# EAGLE design Crossing_v1_0 (EAGLE 9.6.2)
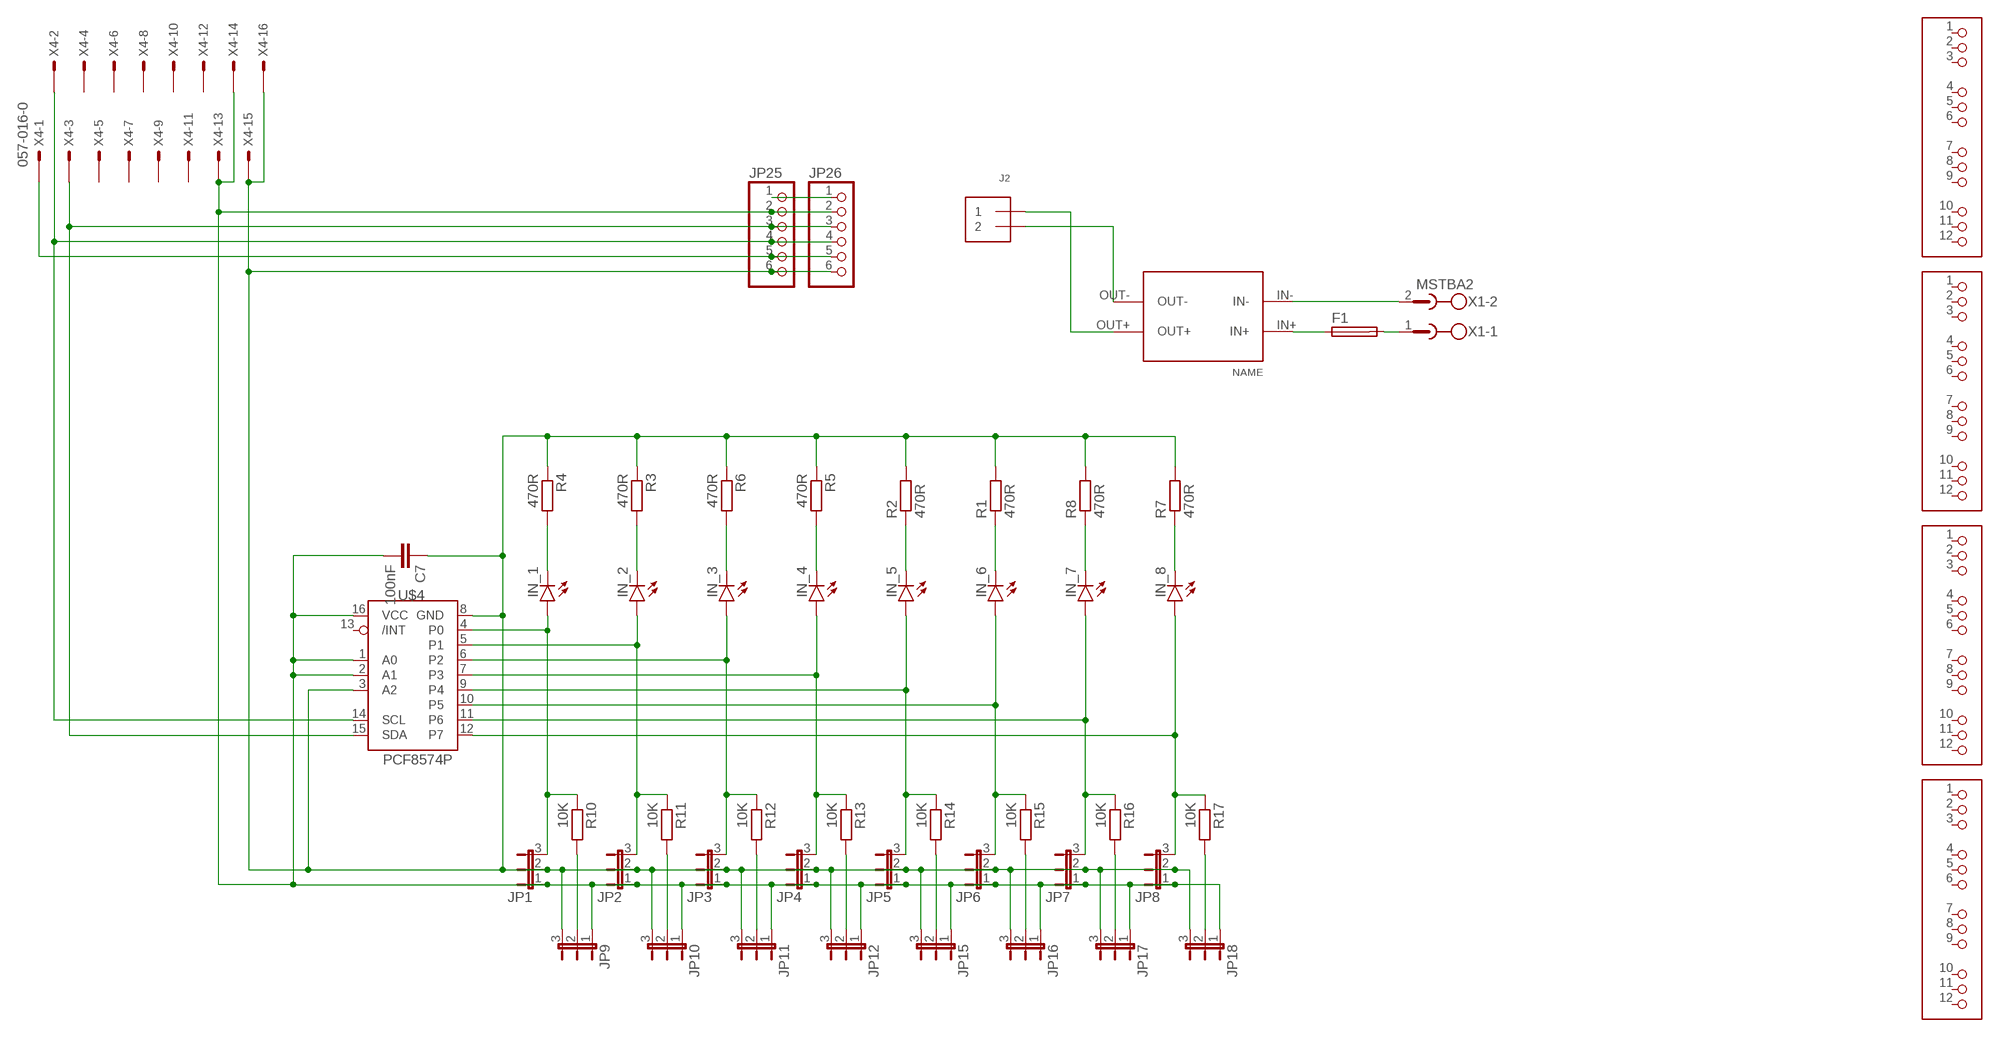
[diagram p0: schematic, sheet 1]

## Parts
C7  100nF  C-EU025-024X044  [C025-024X044]
F1  SH25  [SH25]
IN_1  LED3MM  [LED3MM]
IN_2  LED3MM  [LED3MM]
IN_3  LED3MM  [LED3MM]
IN_4  LED3MM  [LED3MM]
IN_5  LED3MM  [LED3MM]
IN_6  LED3MM  [LED3MM]
IN_7  LED3MM  [LED3MM]
IN_8  LED3MM  [LED3MM]
J2  TERMBLOCK_1X2  [TERMBLOCK_1X2-3.5MM]
JP1  JP2E  [JP2]
JP2  JP2E  [JP2]
JP3  JP2E  [JP2]
JP4  JP2E  [JP2]
JP5  JP2E  [JP2]
JP6  JP2E  [JP2]
JP7  JP2E  [JP2]
JP8  JP2E  [JP2]
JP9  JP2E  [JP2]
JP10  JP2E  [JP2]
JP11  JP2E  [JP2]
JP12  JP2E  [JP2]
JP15  JP2E  [JP2]
JP16  JP2E  [JP2]
JP17  JP2E  [JP2]
JP18  JP2E  [JP2]
JP25  PINHD-1X6CB  [1X06-CLEANBIG]
JP26  PINHD-1X6CB  [1X06-CLEANBIG]
JP27  HEADER-3X04  [3X04]
JP28  HEADER-3X04  [3X04]
JP29  HEADER-3X04  [3X04]
JP30  HEADER-3X04  [3X04]
R1  470R  R-EU_0309/10  [0309/10]
R2  470R  R-EU_0309/10  [0309/10]
R3  470R  R-EU_0309/10  [0309/10]
R4  470R  R-EU_0309/10  [0309/10]
R5  470R  R-EU_0309/10  [0309/10]
R6  470R  R-EU_0309/10  [0309/10]
R7  470R  R-EU_0309/10  [0309/10]
R8  470R  R-EU_0309/10  [0309/10]
R10  10K  R-EU_0309/10  [0309/10]
R11  10K  R-EU_0309/10  [0309/10]
R12  10K  R-EU_0309/10  [0309/10]
R13  10K  R-EU_0309/10  [0309/10]
R14  10K  R-EU_0309/10  [0309/10]
R15  10K  R-EU_0309/10  [0309/10]
R16  10K  R-EU_0309/10  [0309/10]
R17  10K  R-EU_0309/10  [0309/10]
U$2  CP8-ADJ  [CP8-ADJ]
U$4  PCF8574P  [DIL16]
X1  MSTBA2  [MSTBA2]
X4  057-016-0  [057-016-0]

## Nets
N$1: J2.2 U$2.OUT-
N$2: J2.1 U$2.OUT+
N$3: JP25.4 JP26.4 U$4.14(SCL) X4.2
N$4: JP25.5 JP26.5 X4.1
N$5: C7.1 JP1.2 JP2.2 JP3.2 JP4.2 JP5.2 JP6.2 JP7.2 JP8.2 JP9.3 JP10.3 JP11.3 JP12.3 JP15.3 JP16.3 JP17.3 JP18.3 JP25.6 JP26.6 R1.2 R2.2 R3.1 R4.1 R5.1 R6.1 R7.2 R8.2 U$4.3(A2) U$4.8(GND) X4.15 X4.16
N$6: JP25.1 JP26.1
N$7: C7.2 JP1.1 JP2.1 JP3.1 JP4.1 JP5.1 JP6.1 JP7.1 JP8.1 JP9.1 JP10.1 JP11.1 JP12.1 JP15.1 JP16.1 JP17.1 JP18.1 JP25.2 JP26.2 U$4.1(A0) U$4.2(A1) U$4.16(VCC) X4.13 X4.14
N$8: U$2.IN- X1.2
N$9: F1.1 U$2.IN+
N$10: F1.2 X1.1
N$11: JP25.3 JP26.3 U$4.15(SDA) X4.3
N$12: IN_8.K(C) R7.1
N$13: IN_7.K(C) R8.1
N$14: IN_6.K(C) R1.1
N$15: IN_5.K(C) R2.1
N$16: IN_4.K(C) R5.2
N$17: IN_3.K(C) R6.2
N$18: IN_2.K(C) R3.2
N$19: IN_1.K(C) R4.2
N$21: IN_1.A JP1.3 R10.1 U$4.4(P0)
N$22: IN_2.A JP2.3 R11.1 U$4.5(P1)
N$23: IN_3.A JP3.3 R12.1 U$4.6(P2)
N$24: IN_4.A JP4.3 R13.1 U$4.7(P3)
N$25: IN_5.A JP5.3 R14.1 U$4.9(P4)
N$26: IN_6.A JP6.3 R15.1 U$4.10(P5)
N$27: IN_7.A JP7.3 R16.1 U$4.11(P6)
N$28: IN_8.A JP8.3 R17.1 U$4.12(P7)
N$29: JP9.2 R10.2
N$30: JP10.2 R11.2
N$31: JP11.2 R12.2
N$32: JP12.2 R13.2
N$33: JP15.2 R14.2
N$34: JP16.2 R15.2
N$35: JP17.2 R16.2
N$36: JP18.2 R17.2
Unconnected: JP27.1 JP27.2 JP27.3 JP27.4 JP27.5 JP27.6 JP27.7 JP27.8 JP27.9 JP27.10 JP27.11 JP27.12 JP28.1 JP28.2 JP28.3 JP28.4 JP28.5 JP28.6 JP28.7 JP28.8 JP28.9 JP28.10 JP28.11 JP28.12 JP29.1 JP29.2 JP29.3 JP29.4 JP29.5 JP29.6 JP29.7 JP29.8 JP29.9 JP29.10 JP29.11 JP29.12 JP30.1 JP30.2 JP30.3 JP30.4 JP30.5 JP30.6 JP30.7 JP30.8 JP30.9 JP30.10 JP30.11 JP30.12 U$4.13(/INT) X4.4 X4.5 X4.6 X4.7 X4.8 X4.9 X4.10 X4.11 X4.12

## Library data of the parts
C7 = resistor:C-EU: CAPACITOR, European symbol
F1 = fuse:SH25: FUSE HOLDER grid 25 mm, OGN0031 8211, Schurter (Buerklin); MF: SCHURTER; MPN: 0031.8211; OC_FARNELL: 1162741; OC_NEWARK: 96B9380
IN_1-IN_8 = led:LED: LED OSRAM: - CHIPLED LG R971, LG N971, LY N971, LG Q971, LY Q971, LO R971, LY R971 LH N974, LH R974 LS Q976, LO Q976, LY Q976 LO Q996 - Hyper CHIPLED LW Q18S LB Q993, LB Q99A, LB R99A - SideLED LS A670, LO A670, LY A670, LG A670, LP A670 LB A673, LV A673, LT A673, LW A673 LH A674 LY A675 LS A676, LA A676, LO A676, LY A676, LW A676 LS A679, LY A679, LG A679 - Hyper Micro SIDELED® LS Y876, LA Y876, LO Y876, LY Y876 LT Y87S - SmartLED LW L88C, LW L88S LB L89C, LB L89S, LG L890 LS L89K, LO L89K, LY L89K LS L896, LA L896, LO L896, LY L896 - TOPLED LS T670, LO T670, LY T670, LG T670, LP T670 LSG T670, LSP T670, LSY T670, LOP T670, LYG T670 LG T671, LOG T671, LSG T671 LB T673, LV T673, LT T673, LW T673 LH T674 LS T676, LA T676, LO T676, LY T676, LB T676, LH T676, LSB T676, LW T676 LB T67C, LV T67C, LT T67C, LS T67K, LO T67K, LY T67K, LW E67C LS E67B, LA E67B, LO E67B, LY E67B, LB E67C, LV E67C, LT E67C LW T67C LS T679, LY T679, LG T679 LS T770, LO T770, LY T770, LG T770, LP T770 LB T773, LV T773, LT T773, LW T773 LH T774 LS E675, LA E675, LY E675, LS T675 LS T776, LA T776, LO T776, LY T776, LB T776 LHGB T686 LT T68C, LB T68C - Hyper Mini TOPLED® LB M676 - Mini TOPLED Santana® LG M470 LS M47K, LO M47K, LY M47K Source: http://www.osram.convergy.de LUXEON: - LUMILED® LXK2-PW12-R00, LXK2-PW12-S00, LXK2-PW14-U00, LXK2-PW14-V00 LXK2-PM12-R00, LXK2-PM12-S00, LXK2-PM14-U00 LXK2-PE12-Q00, LXK2-PE12-R00, LXK2-PE12-S00, LXK2-PE14-T00, LXK2-PE14-U00 LXK2-PB12-K00, LXK2-PB12-L00, LXK2-PB12-M00, LXK2-PB14-N00, LXK2-PB14-P00, LXK2-PB14-Q00 LXK2-PR12-L00, LXK2-PR12-M00, LXK2-PR14-Q00, LXK2-PR14-R00 LXK2-PD12-Q00, LXK2-PD12-R00, LXK2-PD12-S00 LXK2-PH12-R00, LXK2-PH12-S00 LXK2-PL12-P00, LXK2-PL12-Q00, LXK2-PL12-R00 Source: www.luxeon.com KINGBRIGHT: KA-3528ASYC Source: www.kingbright.com
J2 = microbuilder:TERMBLOCK_1X2: 3.5mm Terminal block http://www.ladyada.net/library/pcb/eaglelibrary.html
JP1-JP12 JP15-JP18 = jumper:JP2E: JUMPER
JP25 JP26 = adafruit:PINHD-1X6: PIN HEADER
JP27-JP30 = microbuilder:HEADER-3X04
R1-R8 R10-R17 = resistor:R-EU_: RESISTOR, European symbol
U$2 = userlib:CP8-ADJ: Voltage regulator IN: 7-35V OUT: ADJ
U$4 = i2c:PCF8574: Remote 8-Bit I/O Expander for I²C Bus
X1 = con-phoenix-508:MSTBA2: PHOENIX; MF: FARNELL; MPN: 1757242; OC_FARNELL: 3705171; OC_NEWARK: 71C4161
X4 = con-panduit:057-016-: CONNECTOR 10-pin series 057 contact pc board low profile headers; OC_FARNELL: unknown; OC_NEWARK: unknown

## Board
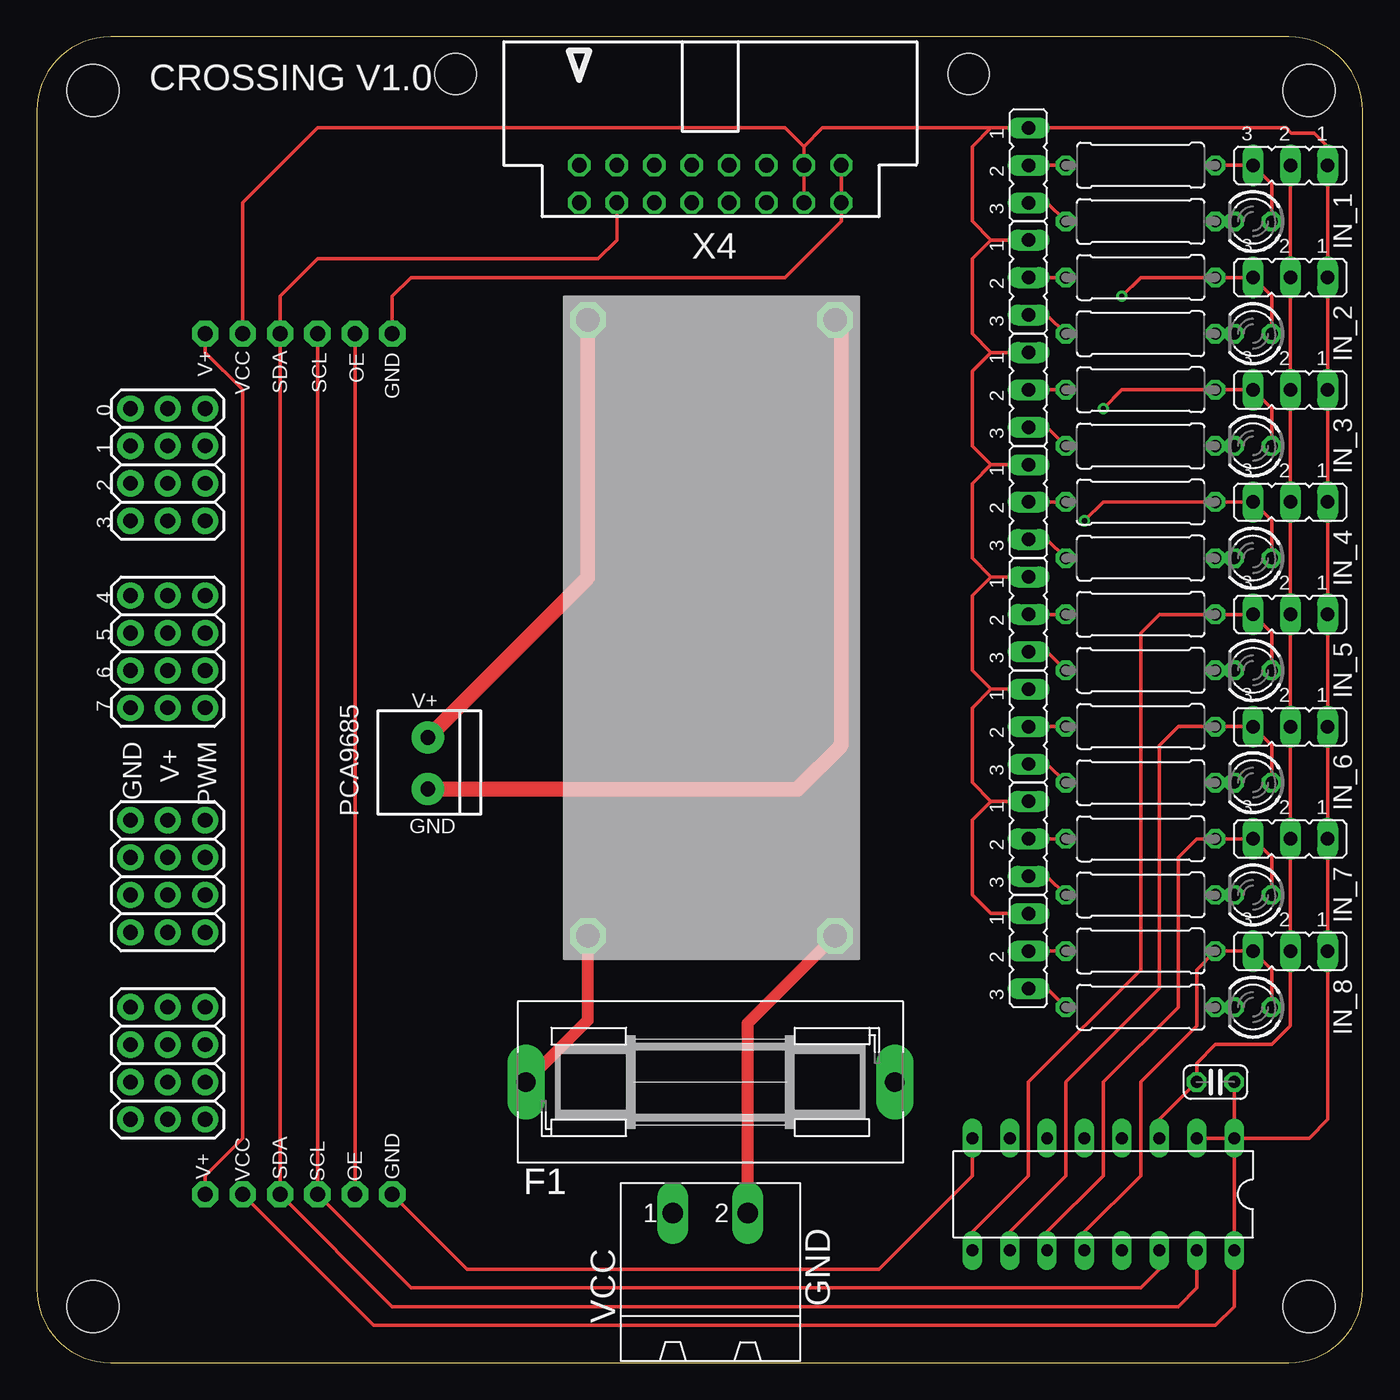
[diagram p1: board, top side]
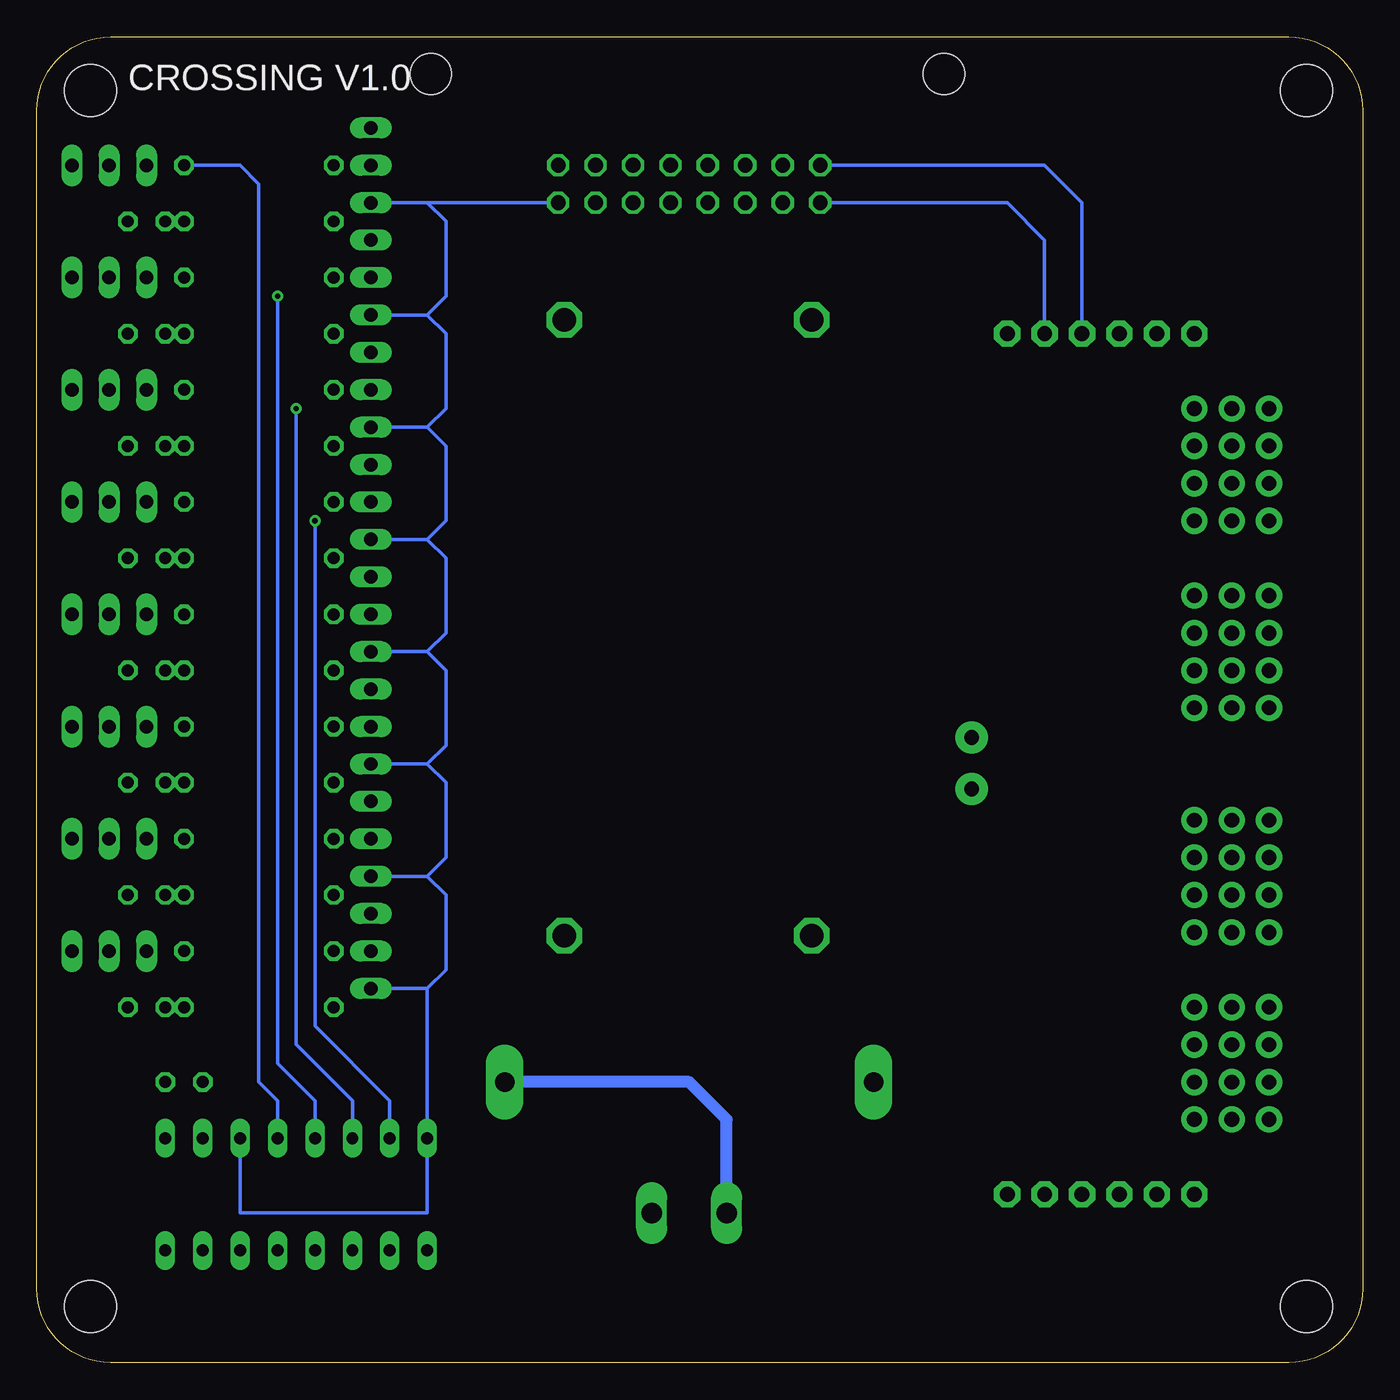
[diagram p2: board, bottom side, seen from below]

Size 90 x 90 mm. Coordinates in mm from the lower left corner, seen from the top.
Outline: 0,85 0,5 arc90 5,0 85,0 arc90 90,5 90,85 arc90 85,90 5,90 arc90 0,85
Copper layers (1*16): Top 0.035mm / dielectric 1.5mm / Bottom 0.035mm
Design rules "default": minimum track width 6mil, minimum drill 0.35mm, track to track 6mil, track to pad 6mil, pad to pad 6mil, via to via 6mil, smd to smd 6mil, copper to edge 40mil, drill to drill 6mil, minimum pad ring 10mil, minimum via ring 8mil, stop-mask expansion 4mil, vias tented up to drill 0mil, thermal gap 10mil
Holes 3.5 mm at 86.36,86.36 3.81,86.36 3.81,3.81 86.36,3.81

### Footprints (pad centres in the part's own frame; a part is rotated, then mirrored left to right if it is on the bottom)
C025-024X044 = drill 0.813 octagon: 1 -1.27,0; 2 1.27,0
SH25 = drill 1.321 pad 2.54 long: 1 -12.522,0; 2 12.522,0
LED3MM = drill 0.813 octagon: A -1.27,0; K 1.27,0
TERMBLOCK_1X2-3.5MM = drill 1 pad 2.184: 1 1.8,0; 2 -1.7,0
JP2 = drill 0.914 long: 1 -2.54,0; 2 0,0; 3 2.54,0
1X06-CLEANBIG = drill 1.016 pad 1.778 octagon: 1 -6.35,0; 2 -3.81,0; 3 -1.27,0; 4 1.27,0; 5 3.81,0; 6 6.35,0
3X04 = drill 1 pad 1.778: 1 -3.81,-2.54; 2 -3.81,0; 3 -3.81,2.54; 4 -1.27,-2.54; 5 -1.27,0; 6 -1.27,2.54; 7 1.27,-2.54; 8 1.27,0; 9 1.27,2.54; 10 3.81,-2.54; 11 3.81,0; 12 3.81,2.54
0309/10 = drill 0.813 octagon: 1 -5.08,0; 2 5.08,0
CP8-ADJ = drill 1.6 octagon: IN+ -21.81,7.05; IN- -21.81,-9.75; OUT+ 19.99,7.05; OUT- 19.99,-9.75
DIL16 = drill 0.813 long: 1 -8.89,-3.81; 2 -6.35,-3.81; 3 -3.81,-3.81; 4 -1.27,-3.81; 5 1.27,-3.81; 6 3.81,-3.81; 7 6.35,-3.81; 8 8.89,-3.81; 9 8.89,3.81; 10 6.35,3.81; 11 3.81,3.81; 12 1.27,3.81; 13 -1.27,3.81; 14 -3.81,3.81; 15 -6.35,3.81; 16 -8.89,3.81
MSTBA2 = drill 1.397 long: 1 -2.54,5.08; 2 2.54,5.08
057-016-0 = drill 1 octagon: 1 -8.89,-5.08; 2 -8.89,-2.54; 3 -6.35,-5.08; 4 -6.35,-2.54; 5 -3.81,-5.08; 6 -3.81,-2.54; 7 -1.27,-5.08; 8 -1.27,-2.54; 9 1.27,-5.08; 10 1.27,-2.54; 11 3.81,-5.08; 12 3.81,-2.54; 13 6.35,-5.08; 14 6.35,-2.54; 15 8.89,-5.08; 16 8.89,-2.54 | hole 2.8: -17.29,3.66; 17.54,3.66

### Placement (x,y rotation side)
C7  80.01,19.05 0 top
F1  45.72,19.05 0 top
IN_1  82.55,77.47 180 top
IN_2  82.55,69.85 180 top
IN_3  82.55,62.23 180 top
IN_4  82.55,54.61 180 top
IN_5  82.55,46.99 180 top
IN_6  82.55,39.37 180 top
IN_7  82.55,31.75 180 top
IN_8  82.55,24.13 180 top
J2  26.54,40.64 90 top
JP1  85.09,81.28 180 top
JP2  85.09,73.66 180 top
JP3  85.09,66.04 180 top
JP4  85.09,58.42 180 top
JP5  85.09,50.8 180 top
JP6  85.09,43.18 180 top
JP7  85.09,35.56 180 top
JP8  85.09,27.94 180 top
JP9  67.31,81.28 270 top
JP10  67.31,73.66 270 top
JP11  67.31,66.04 270 top
JP12  67.31,58.42 270 top
JP15  67.31,50.8 270 top
JP16  67.31,43.18 270 top
JP17  67.31,35.56 270 top
JP18  67.31,27.94 270 top
JP25  17.78,69.85 0 top
JP26  17.78,11.43 0 top
JP27  8.89,48.26 90 top
JP28  8.89,60.96 90 top
JP29  8.89,20.32 90 top
JP30  8.89,33.02 90 top
R1  74.93,39.37 180 top
R2  74.93,46.99 180 top
R3  74.93,69.85 0 top
R4  74.93,77.47 0 top
R5  74.93,54.61 0 top
R6  74.93,62.23 0 top
R7  74.93,24.13 180 top
R8  74.93,31.75 180 top
R10  74.93,81.28 180 top
R11  74.93,73.66 180 top
R12  74.93,66.04 180 top
R13  74.93,58.42 180 top
R14  74.93,50.8 180 top
R15  74.93,43.18 180 top
R16  74.93,35.56 180 top
R17  74.93,27.94 180 top
U$2  44.45,50.8 90 top
U$4  72.39,11.43 180 top
X1  45.72,5.08 0 top
X4  45.72,83.82 0 top

### Tracks (layer width: path | path; a pad name or v marks a point on that pad's centre or on a via)
N$1
  Top 1.016: J2.2 51.64,38.94 54.61,41.91 54.61,70.38 U$2.OUT-
N$2
  Top 1.016: J2.1 37.4,53.3 U$2.OUT+
N$3
  Top 0.254: U$4.14 76.2,6.35 74.93,5.08 25.4,5.08 JP26.4 JP25.4
  Bottom 0.254: JP25.4 19.05,78.74 21.59,81.28 X4.2
N$4
  Top 0.254: JP25.5 JP26.5
  Bottom 0.254: X4.1 24.13,78.74 21.59,76.2 JP25.5
N$5
  Top 0.254: X4.16 X4.15 54.61,77.47 50.8,73.66 25.4,73.66 24.13,72.39 JP25.6 | JP1.2 JP2.2 JP3.2 JP4.2 JP5.2 JP6.2 JP7.2 JP8.2 85.09,22.86 83.82,21.59 80.01,21.59 78.74,20.32 C7.1 76.2,16.51 U$4.3 | R7.2 68.58,25.4 JP18.3 | R8.2 68.58,33.02 JP17.3 | JP16.3 68.58,40.64 R1.2 | JP15.3 68.58,48.26 R2.2 | JP12.3 68.58,55.88 R5.1 | JP11.3 68.58,63.5 R6.1 | JP9.3 68.58,78.74 R4.1 | JP10.3 68.58,71.12 R3.1 | JP26.6 29.21,6.35 57.15,6.35 63.5,12.7 U$4.8
  Bottom 0.254: X4.15 JP9.3 63.5,78.74 62.23,77.47 62.23,72.39 63.5,71.12 | JP10.3 63.5,71.12 | 63.5,71.12 62.23,69.85 62.23,64.77 63.5,63.5 | JP11.3 63.5,63.5 | 63.5,63.5 62.23,62.23 62.23,57.15 63.5,55.88 | JP12.3 63.5,55.88 | 63.5,55.88 62.23,54.61 62.23,49.53 63.5,48.26 | JP15.3 63.5,48.26 | 63.5,48.26 62.23,46.99 62.23,41.91 63.5,40.64 | JP16.3 63.5,40.64 | 63.5,40.64 62.23,39.37 62.23,34.29 63.5,33.02 | JP17.3 63.5,33.02 | 63.5,33.02 62.23,31.75 62.23,26.67 63.5,25.4 | 63.5,25.4 JP18.3 | 63.5,25.4 U$4.8 63.5,10.16 76.2,10.16 U$4.3
N$6
  Top 0.254: JP26.1 11.43,12.7 13.97,15.24 13.97,66.04 11.43,68.58 JP25.1
N$7
  Top 0.254: X4.13 X4.14 52.07,82.55 | 52.07,82.55 50.8,83.82 19.05,83.82 13.97,78.74 JP25.2 | U$4.1 86.36,15.24 87.63,16.51 JP8.1 JP7.1 JP6.1 JP5.1 JP4.1 JP3.1 JP2.1 JP1.1 87.63,82.55 86.71,83.47 85.16,83.47 84.81,83.82 JP9.1 | U$4.1 U$4.16 81.28,3.81 80.01,2.54 22.86,2.54 JP26.2 | U$4.1 C7.2 | JP9.1 53.34,83.82 52.07,82.55 | JP9.1 64.77,83.82 63.5,82.55 63.5,77.47 64.77,76.2 | JP10.1 64.77,76.2 | 64.77,76.2 63.5,74.93 63.5,69.85 64.77,68.58 | JP11.1 64.77,68.58 | 64.77,68.58 63.5,67.31 63.5,62.23 64.77,60.96 | JP12.1 64.77,60.96 | 64.77,60.96 63.5,59.69 63.5,54.61 64.77,53.34 | JP15.1 64.77,53.34 | 64.77,53.34 63.5,52.07 63.5,46.99 64.77,45.72 | JP16.1 64.77,45.72 | 64.77,45.72 63.5,44.45 63.5,39.37 64.77,38.1 | JP17.1 64.77,38.1 | 64.77,38.1 63.5,36.83 63.5,31.75 64.77,30.48 JP18.1 | U$4.1 U$4.2
N$8
  Top 0.813: X1.2 48.26,23.05 U$2.IN-
N$9
  Top 0.813: F1.1 37.4,23.25 U$2.IN+
N$10
  Bottom 0.813: X1.1 43.18,16.51 45.72,19.05 F1.2
N$11
  Top 0.254: X4.3 39.37,76.2 38.1,74.93 19.05,74.93 16.51,72.39 JP25.3 JP26.3 24.13,3.81 77.47,3.81 78.74,5.08 U$4.15
N$12
  Top 0.254: R7.1 IN_8.K
N$13
  Top 0.254: R8.1 IN_7.K
N$14
  Top 0.254: R1.1 IN_6.K
N$15
  Top 0.254: R2.1 IN_5.K
N$16
  Top 0.254: R5.2 IN_4.K
N$17
  Top 0.254: R6.2 IN_3.K
N$18
  Top 0.254: R3.2 IN_2.K
N$19
  Top 0.254: R4.2 IN_1.K
N$21
  Top 0.254: R10.1 JP1.3 83.82,80.01 IN_1.A
  Bottom 0.254: U$4.4 73.66,17.78 74.93,19.05 74.93,80.01 76.2,81.28 R10.1
N$22  (via drill 0.35)
  Top 0.254: IN_2.A 83.82,72.39 JP2.3 R11.1 74.93,73.66 v73.66,72.39
  Bottom 0.254: U$4.5 71.12,17.78 73.66,20.32 v73.66,72.39
N$23  (via drill 0.35)
  Top 0.254: IN_3.A 83.82,64.77 JP3.3 R12.1 73.66,66.04 v72.39,64.77
  Bottom 0.254: U$4.6 68.58,17.78 72.39,21.59 v72.39,64.77
N$24  (via drill 0.35)
  Top 0.254: IN_4.A 83.82,57.15 JP4.3 R13.1 72.39,58.42 v71.12,57.15
  Bottom 0.254: U$4.7 66.04,17.78 71.12,22.86 v71.12,57.15
N$25
  Top 0.254: IN_5.A 83.82,49.53 JP5.3 R14.1 76.2,50.8 74.93,49.53 74.93,26.67 67.31,19.05 67.31,12.7 63.5,8.89 U$4.9
N$26
  Top 0.254: IN_6.A 83.82,41.91 JP6.3 R15.1 77.47,43.18 76.2,41.91 76.2,25.4 69.85,19.05 69.85,12.7 66.04,8.89 U$4.10
N$27
  Top 0.254: IN_7.A 83.82,34.29 JP7.3 R16.1 78.74,35.56 77.47,34.29 77.47,24.13 72.39,19.05 72.39,12.7 68.58,8.89 U$4.11
N$28
  Top 0.254: IN_8.A 83.82,26.67 JP8.3 R17.1 78.74,26.67 78.74,22.86 74.93,19.05 74.93,12.7 71.12,8.89 U$4.12
N$29
  Top 0.254: R10.2 JP9.2
N$30
  Top 0.254: JP10.2 R11.2
N$31
  Top 0.254: JP11.2 R12.2
N$32
  Top 0.254: JP12.2 R13.2
N$33
  Top 0.254: JP15.2 R14.2
N$34
  Top 0.254: JP16.2 R15.2
N$35
  Top 0.254: JP17.2 R16.2
N$36
  Top 0.254: JP18.2 R17.2

### Text on the board
tPlace: V+ | VCC | SDA | SCL | OE | GND | 0 | 1 | 2 | 3 | 4 | 5 | 6 | 7 | PCA9685 | V+ | GND | V+ | PWM | GND | V+ | VCC | SDA | SCL | OE | GND | VCC | GND
tNames: CROSSING V1.0
bNames: CROSSING V1.0